# Altium schematic sheet versterker_R.SchDoc: versterker R
size A4; Author: quinten CRETS; CompanyName: pxl; DocumentNumber: 0.1; Revision: 0; SheetNumber: 2; SheetTotal: 3
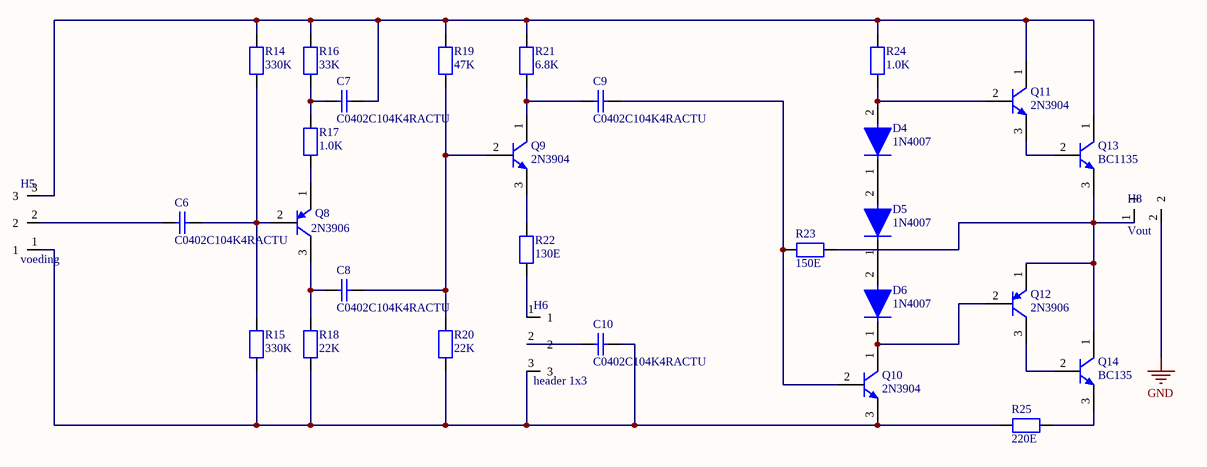
[diagram p0: versterker_R.SchDoc]

## Parts
C6  C0402C104K4RACTU  [capacitor SMD]
C7  C0402C104K4RACTU  [capacitor SMD]
C8  C0402C104K4RACTU  [capacitor SMD]
C9  C0402C104K4RACTU  [capacitor SMD]
C10  C0402C104K4RACTU  [capacitor SMD]
D4  1N4007  [diode]
D5  1N4007  [diode]
D6  1N4007  [diode]
H5  voeding  [header 1x3]
H6  header 1x3  [header 1x3]
H8  Vout  [header 1x2]
Q8  2N3906  [transistor]
Q9  2N3904  [transistor]
Q10  2N3904  [transistor]
Q11  2N3904  [transistor]
Q12  2N3906  [transistor]
Q13  BC1135  [transistor]
Q14  BC135  [transistor]
R14  330K  [resistor smd]
R15  330K  [resistor smd]
R16  33K  [resistor smd]
R17  1.0K  [resistor smd]
R18  22K  [resistor smd]
R19  47K  [resistor smd]
R20  22K  [resistor smd]
R21  6.8K  [resistor smd]
R22  130E  [resistor smd]
R23  150E  [resistor smd]
R24  1.0K  [resistor smd]
R25  220E  [resistor smd]

## Nets
GND: H8.2
NetC6_1: C6.1 H5.2
NetC6_2: C6.2 Q8.2(B) R14.1 R15.2
NetC7_1: C7.1 R16.1 R17.2
NetC7_2: C7.2 H5.3 Q11.1(C) Q13.1(C) R14.2 R16.2 R19.2 R21.2 R24.2
NetC8_1: C8.1 Q8.3(E) R18.2
NetC8_2: C8.2 Q9.2(B) R19.1 R20.2
NetC9_1: C9.1 Q9.1(C) R21.1
NetC9_2: C9.2 Q10.2(B) R23.1
NetC10_1: C10.1 H6.2
NetC10_2: C10.2 H5.1 H6.3 Q10.3(E) R15.1 R18.1 R20.1 R25.1
NetD4_1: D4.1(C) D5.2(A)
NetD4_2: D4.2(A) Q11.2(B) R24.1
NetD5_1: D5.1(C) D6.2(A)
NetD6_1: D6.1(C) Q10.1(C) Q12.2(B)
NetH6_1: H6.1 R22.1
NetH8_1: H8.1 Q12.1(C) Q13.3(E) Q14.1(C) R23.2
NetQ8_1: Q8.1(C) R17.1
NetQ9_3: Q9.3(E) R22.2
NetQ11_3: Q11.3(E) Q13.2(B)
NetQ12_3: Q12.3(E) Q14.2(B)
NetQ14_3: Q14.3(E) R25.2

## Library data of the parts
C6-C10 = capacitor smd: Manufacturer: Kemet; Part Number: C0402C104K4RACTU
D4-D6 = diode: Rectifier diode 1000 V 1 A DO-41, ,; Manufacturer: Diotec; Max Surge Forward Current: 27A; Forward Current: 1A; Max Junction Temp: +175°C; Reverse Voltage: 1000V; Value: 15pF; Peak Reverse Current: 5uA; Category: Diode; Temperature Range Low: -50°C; Automotive: No; Temperature: -50°C to +175°C; Lead Free: Yes; ComponentLink2Description: Datasheet; Max Repetitive Reverse Voltage: 1000V; ComponentLink2URL: https://datasheet.octopart.com/1N4007-Diotec-datasheet-62346875.pdf; Manufacturer Part Number: 1N4007; Device Class L3: Rectifier Diodes; Height: 2.8mm; Octopart: https://octopart.com/1n4007-diotec-4040411; Package: 1N4007; Temperature Range High: +175°C; Device Class L1: Discrete Semiconductors; Device Class L2: Diodes; RoHS: TRUE; Capacitance: 15pF; Ipc Land Pattern Name: DIOAD888W100L520D280
H5 = header 1x3
H6 = header 1x3: slider https://benl.rs-online.com/web/p/potentiometers/7377789?cm_mmc=BE-PLA-DS3A-_-google-_-CSS_BE_NL_Passive_Components_Whoop-_-(BE:Whoop!)+Potentiometers-_-7377789&matchtype=&pla-475798367430&gad_source=1&gclid=CjwKCAjwzN-vBhAkEiwAYiO7oPuJbs9GCJj7CrvxiNsXjA7SlcJ2NwzZNKSjfO0eiH0Rvhaxga3QEBoC9gEQAvD_BwE&gclsrc=aw.ds
H8 = header 1x2
Q8 Q12 = pnp transistor: Amplifier Transistor, NPN Silicon, 3-Pin TO-92, Bulk Box; Manufacturer: On Semiconductor; PartNumber: BC547B; IC Continuous (A): 0.1; fT Min (MHz): 150; DatasheetVersion: Rev. 7; ComponentLink1URL: http://www.onsemi.com/; Polarity: NPN; RoHS: FALSE; ComponentLink1Description: Manufacturer URL; Packing: Bulk Box; PackageDescription: 3-Pin Transistor Outline, Body 4.825 x 3.685 mm, Pitch 1.27 mm; ComponentLink3URL: http://www.onsemi.cn/pub_link/Collateral/2N6426-D.PDF; ComponentLink2Description: Datasheet; PackageVersion: Rev. AM; PackageReference: TO-92-3-29-11_AM_SL; ComponentLink3Description: Package Specification; Mounting Technology: Through Hole; ComponentLink2URL: http://www.onsemi.com/pub_link/Collateral/BC546-D.PDF
Q9-Q11 Q13 Q14 = npn transistor: Amplifier Transistor, NPN Silicon, 3-Pin TO-92, Bulk Box; Manufacturer: On Semiconductor; PartNumber: BC547B; IC Continuous (A): 0.1; fT Min (MHz): 150; DatasheetVersion: Rev. 7; ComponentLink1URL: http://www.onsemi.com/; Polarity: NPN; RoHS: FALSE; ComponentLink1Description: Manufacturer URL; Packing: Bulk Box; PackageDescription: 3-Pin Transistor Outline, Body 4.825 x 3.685 mm, Pitch 1.27 mm; ComponentLink3URL: http://www.onsemi.cn/pub_link/Collateral/2N6426-D.PDF; ComponentLink2Description: Datasheet; PackageVersion: Rev. AM; PackageReference: TO-92-3-29-11_AM_SL; ComponentLink3Description: Package Specification; Mounting Technology: Through Hole; ComponentLink2URL: http://www.onsemi.com/pub_link/Collateral/BC546-D.PDF
R14-R25 = resistor smd: Manufacturer: Vishay Dale; Part Number: CRCW08050000Z0EA